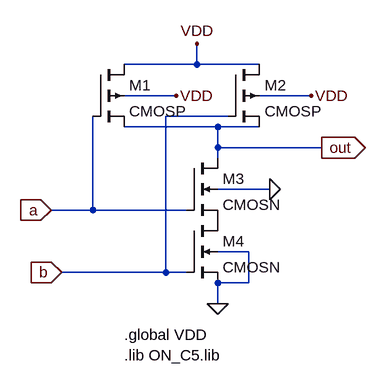
[diagram p0: schematic nand.asc]
nand.asc, the LTspice schematic file:
Version 4
SHEET 1 900 680
WIRE 160 -32 160 -64
WIRE 160 -32 48 -32
WIRE 256 -32 160 -32
WIRE 128 16 48 16
WIRE 336 16 256 16
WIRE 208 48 112 48
WIRE 192 64 48 64
WIRE 256 64 192 64
WIRE 192 96 192 64
WIRE 352 96 192 96
WIRE 192 112 192 96
WIRE 272 160 192 160
WIRE 0 192 0 48
WIRE 0 192 -64 192
WIRE 144 192 0 192
WIRE 240 256 192 256
WIRE 112 288 112 48
WIRE 112 288 -48 288
WIRE 144 288 112 288
WIRE 240 304 240 256
WIRE 240 304 192 304
WIRE 192 336 192 304
FLAG 352 96 out
IOPIN 352 96 Out
FLAG -64 192 a
IOPIN -64 192 In
FLAG 192 336 0
FLAG 160 -64 VDD
FLAG -48 288 b
IOPIN -48 288 In
FLAG 336 16 VDD
FLAG 128 16 VDD
FLAG 272 160 0
SYMBOL pmos4 0 -32 R0
SYMATTR InstName M1
SYMATTR Value CMOSP
SYMATTR Value2 l=0.6u w=1.8u
SYMBOL pmos4 208 -32 R0
SYMATTR InstName M2
SYMATTR Value CMOSP
SYMATTR Value2 l=0.6u w=1.8u
SYMBOL nmos4 144 112 R0
SYMATTR InstName M3
SYMATTR Value CMOSN
SYMATTR Value2 l=0.6u w=1.8u
SYMBOL nmos4 144 208 R0
SYMATTR InstName M4
SYMATTR Value CMOSN
SYMATTR Value2 l=0.6u w=1.8u
TEXT 48 384 Left 2 !.global VDD\n.lib ON_C5.lib

The netlist it stands for:
* nand.asc
M1 VDD a out VDD CMOSP l=0.6u w=1.8u
M2 VDD b out VDD CMOSP l=0.6u w=1.8u
M3 out a P001 0 CMOSN l=0.6u w=1.8u
M4 P001 b 0 0 CMOSN l=0.6u w=1.8u
.model NMOS NMOS
.model PMOS PMOS
.lib standard.mos
.global VDD
.lib ON_C5.lib
.backanno
.end